# Altium schematic sheet Multiplexer.SchDoc
size A4; SheetNumber: 6; SheetTotal: 6
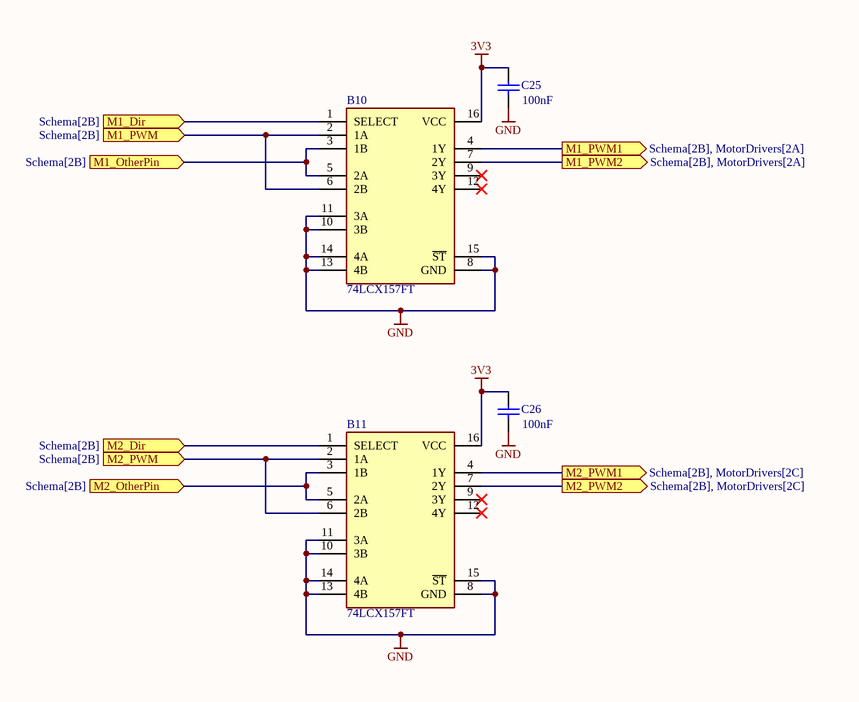
[diagram p0: Multiplexer.SchDoc]

## Parts
B10  74LCX157FT  [SOP65P640X120-16M]
B11  74LCX157FT  [SOP65P640X120-16M]
C25  value 100nF  [0805_Lorin]  (hidden comment: Cap)
C26  value 100nF  [0805_Lorin]  (hidden comment: Cap)

## Ports
M1_Dir (in, see Schema[2B]), M1_OtherPin (in, see Schema[2B]), M1_PWM1 (out, see Schema[2B], MotorDrivers[2A]), M1_PWM2 (out, see Schema[2B], MotorDrivers[2A]), M1_PWM (in, see Schema[2B]), M2_Dir (in, see Schema[2B]), M2_OtherPin (in, see Schema[2B]), M2_PWM1 (out, see Schema[2B], MotorDrivers[2C]), M2_PWM2 (out, see Schema[2B], MotorDrivers[2C]), M2_PWM (in, see Schema[2B])

## Nets
3V3: B10.16(VCC) B11.16(VCC) C25.1 C26.1
GND: B10.8(GND) B10.10(3B) B10.11(3A) B10.13(4B) B10.14(4A) B10.15(~{ST}) B11.8(GND) B11.10(3B) B11.11(3A) B11.13(4B) B11.14(4A) B11.15(~{ST}) C25.2 C26.2
M1_Dir: B10.1(SELECT) ; port M1_Dir
M1_OtherPin: B10.3(1B) B10.5(2A) ; port M1_OtherPin
M1_PWM: B10.2(1A) B10.6(2B) ; port M1_PWM
M1_PWM1: B10.4(1Y) ; port M1_PWM1
M1_PWM2: B10.7(2Y) ; port M1_PWM2
M2_Dir: B11.1(SELECT) ; port M2_Dir
M2_OtherPin: B11.3(1B) B11.5(2A) ; port M2_OtherPin
M2_PWM: B11.2(1A) B11.6(2B) ; port M2_PWM
M2_PWM1: B11.4(1Y) ; port M2_PWM1
M2_PWM2: B11.7(2Y) ; port M2_PWM2

Not connected (* = marked no-connect by the designer): B10 9(3Y)* 12(4Y)*; B11 9(3Y)* 12(4Y)*

## Library data of the parts
B10 B11 = 74LCX157FT: 74LCX157FT Toshiba, Multiplexer Quad, -0.5  6.5 V, 16-Pin TSSOP; Geometry.Height: 1.2mm; Mouser Part Number: 757-74LCX157FT; Mouser Price/Stock: https://www.mouser.co.uk/ProductDetail/Toshiba/74LCX157FT?qs=F5EMLAvA7IBvOqmQf3om6A%3D%3D; Manufacturer_Name: Toshiba; Manufacturer_Part_Number: 74LCX157FT; Datasheet Link: https://toshiba.semicon-storage.com/eu/semiconductor/product/general-purpose-logic-ics/detail.74LCX157FT.html
C25 C26 = Cap: Capacitor; Published: 8-Jun-2000; LatestRevisionDate: 17-Jul-2002; LatestRevisionNote: Re-released for DXP Platform.; PackageReference: RAD-0.3; Publisher: Altium Limited; PackageDescription: Radial Cap, Thru-Hole; 2 Leads; 0.3 in Pin Spacing